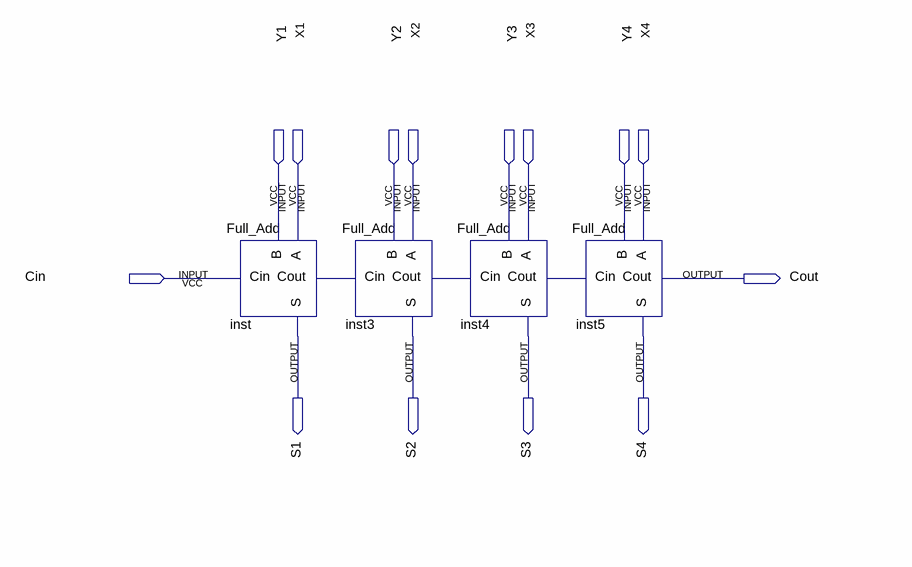
[diagram p0: schematic sheet]
// Quartus schematic 4_bit_add.bdf as structural Verilog: 4 symbols, 14 pins
module \4_bit_add  (
  input  Y1,
  input  X1,
  input  Y2,
  input  X2,
  input  Y3,
  input  X3,
  input  Y4,
  input  X4,
  input  Cin,
  output Cout,
  output S1,
  output S2,
  output S3,
  output S4
);

  wire inst3_cout, inst4_cout, inst_cout;

  Full_Add inst (.A(X1), .B(Y1), .Cin(Cin), .S(S1), .Cout(inst_cout));
  Full_Add inst3 (.A(X2), .B(Y2), .Cin(inst_cout), .S(S2), .Cout(inst3_cout));
  Full_Add inst4 (.A(X3), .B(Y3), .Cin(inst3_cout), .S(S3), .Cout(inst4_cout));
  Full_Add inst5 (.A(X4), .B(Y4), .Cin(inst4_cout), .S(S4), .Cout(Cout));
endmodule
